# Altium schematic sheet MCU.SchDoc
size A4
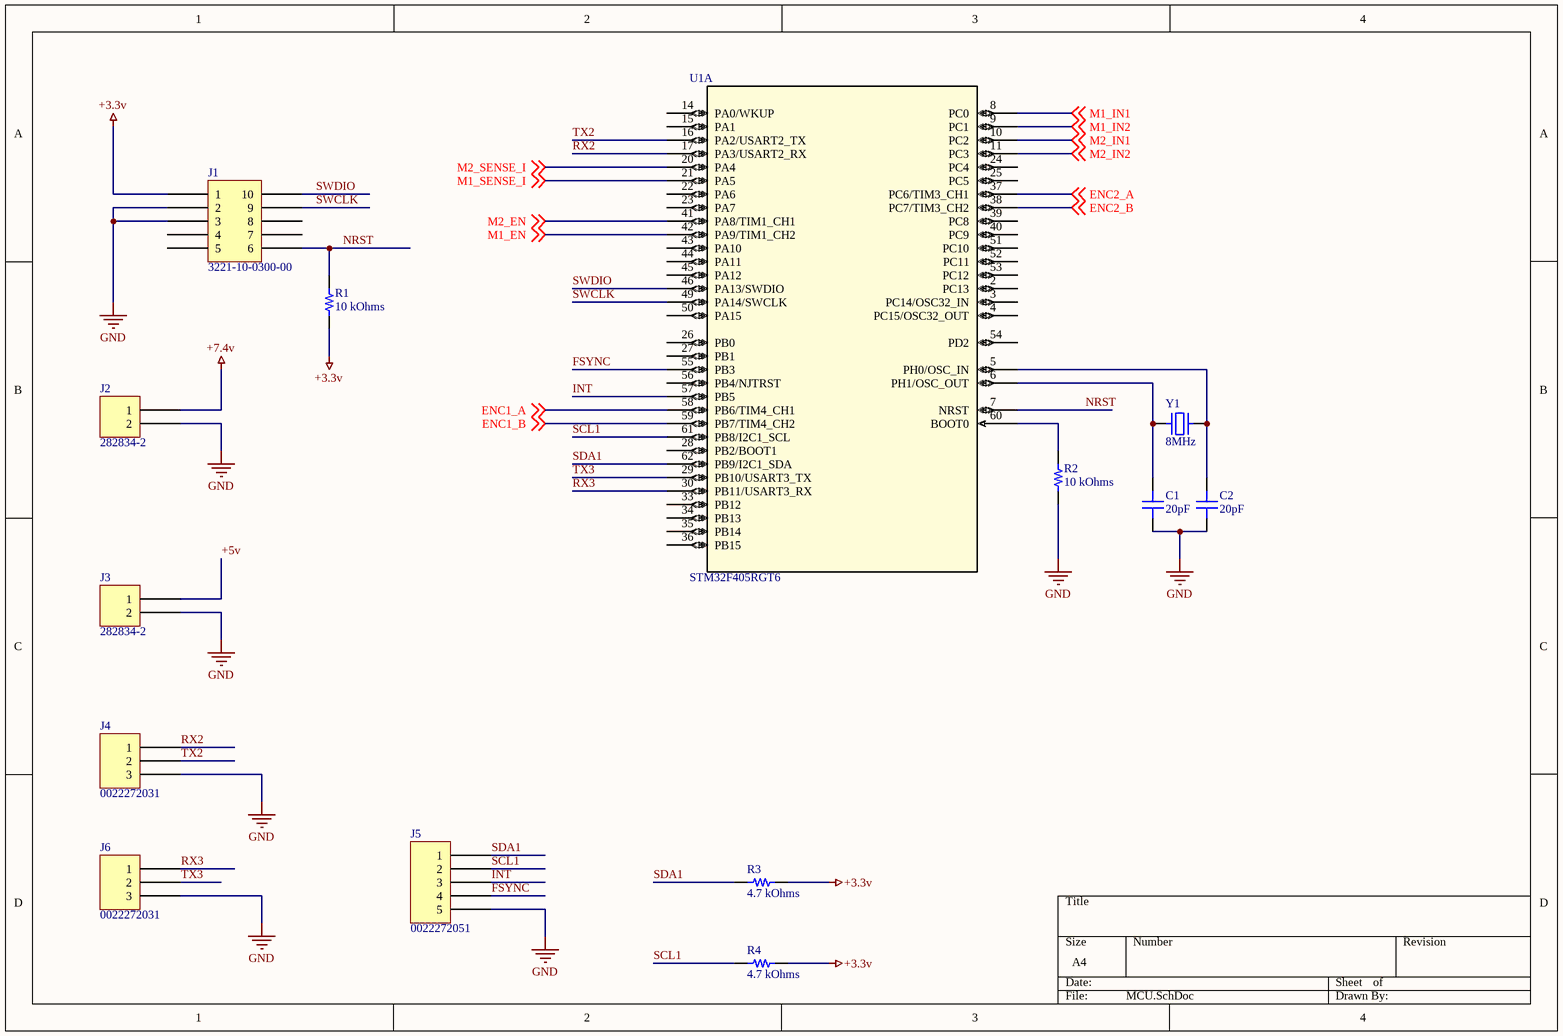
[diagram p0: MCU.SchDoc]

## Parts
C1  20pF  [CAP 0805_2012]
C2  20pF  [CAP 0805_2012]
J1  3221-10-0300-00  [CNC TECH 3221-10-0300-00]
J2  282834-2  [TE 282834-2]
J3  282834-2  [TE 282834-2]
J4  0022272031  [MOLEX KK 0022272031]
J5  0022272051  [MOLEX KK 0022272051]
J6  0022272031  [MOLEX KK 0022272031]
R1  10 kOhms  [RES 0805_2012]
R2  10 kOhms  [RES 0805_2012]
R3  4.7 kOhms  [RES 0805_2012]
R4  4.7 kOhms  [RES 0805_2012]
U1  STM32F405RGT6  [LQFP64-10x10mm]  (part A of 2)
Y1  8MHz  [NDK NX5032GA]

## Nets
+3.3v: J1.1 R1.2 R3.2 R4.2
+7.4v: J2.1
GND: C1.1 C2.1 J1.2 J1.3 J2.2 J3.2 J4.3 J5.5 J6.3 R2.1
+5v: J3.1
ENC1_A: U1.58(PB6/TIM4_CH1) ; off-sheet ENC1_A
ENC1_B: U1.59(PB7/TIM4_CH2) ; off-sheet ENC1_B
ENC2_A: U1.37(PC6/TIM3_CH1) ; off-sheet ENC2_A
ENC2_B: U1.38(PC7/TIM3_CH2) ; off-sheet ENC2_B
FSYNC: J5.4 U1.55(PB3)
INT: J5.3 U1.57(PB5)
M1_EN: U1.42(PA9/TIM1_CH2) ; off-sheet M1_EN
M1_IN1: U1.8(PC0) ; off-sheet M1_IN1
M1_IN2: U1.9(PC1) ; off-sheet M1_IN2
M1_SENSE_I: U1.21(PA5) ; off-sheet M1_SENSE_I
M2_EN: U1.41(PA8/TIM1_CH1) ; off-sheet M2_EN
M2_IN1: U1.10(PC2) ; off-sheet M2_IN1
M2_IN2: U1.11(PC3) ; off-sheet M2_IN2
M2_SENSE_I: U1.20(PA4) ; off-sheet M2_SENSE_I
NRST: J1.6 R1.1 U1.7(NRST)
RX2: J4.1 U1.17(PA3/USART2_RX)
RX3: J6.1 U1.30(PB11/USART3_RX)
SCL1: J5.2 R4.1 U1.61(PB8/I2C1_SCL)
SDA1: J5.1 R3.1 U1.62(PB9/I2C1_SDA)
SWCLK: J1.9 U1.49(PA14/SWCLK)
SWDIO: J1.10 U1.46(PA13/SWDIO)
TX2: J4.2 U1.16(PA2/USART2_TX)
TX3: J6.2 U1.29(PB10/USART3_TX)
NetC1_2: C1.2 U1.6(PH1/OSC_OUT) Y1.1
NetC2_2: C2.2 U1.5(PH0/OSC_IN) Y1.2
NetR2_2: R2.2 U1.60(BOOT0)

Not connected (* = marked no-connect by the designer): J1 4 5 7 8; U1 2(PC13) 3(PC14/OSC32_IN) 4(PC15/OSC32_OUT) 14(PA0/WKUP) 15(PA1) 22(PA6) 23(PA7) 24(PC4) 25(PC5) 26(PB0) 27(PB1) 28(PB2/BOOT1) 33(PB12) 34(PB13) 35(PB14) 36(PB15) 39(PC8) 40(PC9) 43(PA10) 44(PA11) 45(PA12) 50(PA15) 51(PC10) 52(PC11) 53(PC12) 54(PD2) 56(PB4/NJTRST)

## Library data of the parts
C1 C2 = C0805C200J4GAC7800: CAP CER 20PF 16V C0G/NP0 0805; Manufacturer: KEMET; Temperature Coefficient: C0G, NP0; Tolerance: ±5%; Part Number: C0805C200J4GAC7800; Value: 20pF; Applications: General Purpose; Capacitance: 20pF; ComponentLink1Description: Datasheet; ComponentLink1URL: https://api.kemet.com/component-edge/download/datasheet/C0805C200J4GAC7800.pdf; ComponentLink2Description: DigiKey Link; ComponentLink2URL: http://digikey.com/product-detail/en/kemet/C0805C200J4GAC7800/399-9987-1-ND/3736986; Device Package: 0805 (2012 Metric); Features: Low ESL; LastUpdated: 9/2/2020 1:04:36 AM; Lifecycle Status: Active; Minimum Order: 1; Mounting Type: Surface Mount, MLCC; Operating Temperature: -55°C ~ 125°C; Package / Case: 0805 (2012 Metric); Packaging: TapeAndReel; PartId: 5865; Part Status: Active; Price: 0.06; Series: SMD Comm C0G; Size / Dimension: 0.079" L x 0.049" W (2.00mm x 1.25mm); Supplier 1: DigiKey; Supplier Part Number 1: 399-9987-1-ND; Thickness (Max): 0.035" (0.88mm); Voltage - Rated: 16V
J1 = 3221-10-0300-00: CONN HEADER SMD 10POS 1.27MM; Manufacturer: CNC Tech; Current Rating (Amps): 1A; Material Flammability Rating: UL94 V-0; Number of Positions: 10; Number of Positions Loaded: All; Pitch - Mating: 0.050" (1.27mm); Shrouding: Shrouded - 4 Wall; Style: Board to Cable/Wire; Part Number: 3221-10-0300-00; ComponentLink1Description: Datasheet; ComponentLink1URL: http://cnctech.us/idcmatching2.pdf; ComponentLink2Description: DigiKey Link; ComponentLink2URL: http://digikey.com/product-detail/en/cnc-tech/3221-10-0300-00/1175-1735-ND/4878946; Connector Type: Header; Contact Finish - Mating: Gold; Contact Finish - Post: Gold; Contact Finish Thickness - Mating: Flash; Contact Material: Brass; Contact Shape: Square; Contact Type: Male Pin; Fastening Type: Push-Pull; Features: Keying Slot; Insulation Height: 0.213" (5.40mm); Insulation Material: Polyamide (PA6T), Nylon 6T; LastUpdated: 1/13/2020 12:09:21 AM; Lifecycle Status: Active; Minimum Order: 1; Mounting Type: Surface Mount; Number of Rows: 2; Operating Temperature: -40°C ~ 105°C; Packaging: Tray; PartId: 109; Part Status: Active; Price: 0.73; Row Spacing - Mating: 0.050" (1.27mm); Series: -; Supplier 1: DigiKey; Supplier Part Number 1: 1175-1735-ND; Termination: Solder
J2 J3 = 282834-2: TERM BLK 2P SIDE ENT 2.54MM PCB; Manufacturer: TE Connectivity AMP Connectors; Current: 10A; Mating Orientation: Horizontal with Board; Number of Levels: 1; Pitch: 0.100" (2.54mm); Positions Per Level: 2; Voltage: 150V; Wire Gauge: 16-30 AWG; Wire Termination: Screw - Rising Cage Clamp; Part Number: 282834-2; Color: Green; ComponentLink1Description: Datasheet; ComponentLink1URL: https://www.te.com/commerce/DocumentDelivery/DDEController?Action=srchrtrv&DocNm=282834&DocType=Customer+Drawing&DocLang=English; ComponentLink2Description: DigiKey Link; ComponentLink2URL: http://digikey.com/product-detail/en/te-connectivity-amp-connectors/282834-2/A98333-ND/1150135; LastUpdated: 1/15/2020 4:15:38 AM; Lifecycle Status: Active; Minimum Order: 1; Mounting Type: Through Hole; Packaging: Bulk; Part Status: Active; Price: 0.88; Series: Buchanan; Supplier 1: DigiKey; Supplier Part Number 1: A98333-ND
J4 J6 = 0022272031: CONN HEADER VERT 3POS 2.54MM; Manufacturer: Molex; Contact Length - Mating: 0.295" (7.49mm); Contact Length - Post: 0.140" (3.56mm); Material Flammability Rating: UL94 V-0; Number of Positions: 3; Number of Positions Loaded: All; Overall Contact Length: 0.560" (14.22mm); Pitch - Mating: 0.100" (2.54mm); Shrouding: Shrouded - 1 Wall; Style: Board to Cable/Wire; Part Number: 0022272031; ComponentLink1Description: Datasheet; ComponentLink1URL: https://www.molex.com/pdm_docs/sd/022272031_sd.pdf; ComponentLink2Description: DigiKey Link; ComponentLink2URL: http://digikey.com/product-detail/en/molex/0022272031/WM4112-ND/1130578; Connector Type: Header; Contact Finish - Mating: Tin; Contact Finish - Post: Tin; Contact Finish Thickness - Mating: 100.0µin (2.54µm); Contact Material: Brass; Contact Shape: Square; Contact Type: Male Pin; Fastening Type: Friction Lock; Insulation Color: Natural; Insulation Height: 0.461" (11.70mm); Insulation Material: Polyamide (PA), Nylon; LastUpdated: 1/12/2020 11:51:54 PM; Lifecycle Status: Active; Minimum Order: 1; Mounting Type: Through Hole; Number of Rows: 1; Packaging: Bulk; PartId: 77; Part Status: Active; Price: 0.37; Series: KK 6410; Supplier 1: DigiKey; Supplier Part Number 1: WM4112-ND; Termination: Solder
J5 = 0022272051: CONN HEADER VERT 5POS 2.54MM; Manufacturer: Molex; Contact Length - Mating: 0.295" (7.49mm); Contact Length - Post: 0.140" (3.56mm); Material Flammability Rating: UL94 V-0; Number of Positions: 5; Number of Positions Loaded: All; Overall Contact Length: 0.560" (14.22mm); Pitch - Mating: 0.100" (2.54mm); Shrouding: Shrouded - 1 Wall; Style: Board to Cable/Wire; Part Number: 0022272051; ComponentLink1Description: Datasheet; ComponentLink1URL: https://www.molex.com/pdm_docs/sd/022272051_sd.pdf; ComponentLink2Description: DigiKey Link; ComponentLink2URL: http://digikey.com/product-detail/en/molex/0022272051/WM4114-ND/1130580; Connector Type: Header; Contact Finish - Mating: Tin; Contact Finish - Post: Tin; Contact Finish Thickness - Mating: 100.0µin (2.54µm); Contact Material: Brass; Contact Shape: Square; Contact Type: Male Pin; Fastening Type: Friction Lock; Insulation Color: Natural; Insulation Height: 0.461" (11.70mm); Insulation Material: Polyamide (PA), Nylon; LastUpdated: 1/12/2020 11:52:16 PM; Lifecycle Status: Active; Minimum Order: 1; Mounting Type: Through Hole; Number of Rows: 1; Packaging: Bulk; PartId: 79; Part Status: Active; Price: 0.46; Series: KK 6410; Supplier 1: DigiKey; Supplier Part Number 1: WM4114-ND; Termination: Solder
R1 = RMCS0805JT10K0: RES 10K OHM 5% 1/8W 0805; Manufacturer: Stackpole Electronics Inc; Power (Watts): 0.125W, 1/8W; Temperature Coefficient: ±100ppm/°C; Part Number: RMCS0805JT10K0; Value: 10 kOhms; ComponentLink1Description: Datasheet; ComponentLink1URL: https://www.seielect.com/catalog/sei-rmcs.pdf; ComponentLink2Description: DigiKey Link; ComponentLink2URL: http://digikey.com/product-detail/en/stackpole-electronics-inc/RMCS0805JT10K0/RMCS0805JT10K0CT-ND/9770325; Composition: Thick Film; Device Package: 0805 (2012 Metric); Features: Anti-Sulfur; Height - Seated (Max): 0.024" (0.60mm); LastUpdated: 9/2/2020 1:14:40 AM; Lifecycle Status: Active; Minimum Order: 1; Number of Terminations: 2; Operating Temperature: -55°C ~ 155°C; Package / Case: 0805 (2012 Metric); Packaging: TapeAndReel; PartId: 46907; Part Status: Active; Price: 0.01; Resistance: 10 kOhms; Series: RMCS; Size / Dimension: 0.079" L x 0.049" W (2.00mm x 1.25mm); Supplier 1: DigiKey; Supplier Part Number 1: RMCS0805JT10K0CT-ND; Supplier Device Package: 0805; Tolerance: ±5%
R2 = RC0805JR-0710KL: RES SMD 10K OHM 5% 1/8W 0805; Manufacturer: Yageo; Power (Watts): 0.125W, 1/8W; Temperature Coefficient: ±100ppm/°C; Part Number: RC0805JR-0710KL; Value: 10 kOhms; ComponentLink1Description: Datasheet; ComponentLink1URL: https://www.yageo.com/upload/media/product/productsearch/datasheet/rchip/PYu-RC_Group_51_RoHS_L_10.pdf; ComponentLink2Description: DigiKey Link; ComponentLink2URL: http://digikey.com/product-detail/en/yageo/RC0805JR-0710KL/311-10KARCT-ND/731188; Composition: Thick Film; Device Package: 0805 (2012 Metric); Features: Moisture Resistant; Height - Seated (Max): 0.024" (0.60mm); LastUpdated: 9/2/2020 1:15:00 AM; Lifecycle Status: Active; Minimum Order: 1; Number of Terminations: 2; Operating Temperature: -55°C ~ 155°C; Package / Case: 0805 (2012 Metric); Packaging: CutTape; PartId: 38737; Part Status: Active; Price: 0.10; Resistance: 10 kOhms; Series: RC; Size / Dimension: 0.079" L x 0.049" W (2.00mm x 1.25mm); Supplier 1: DigiKey; Supplier Part Number 1: 311-10KARCT-ND; Supplier Device Package: 0805; Tolerance: ±5%
R3 R4 = CRCW08054K70JNTA: RES SMD 4.7K OHM 5% 1/8W 0805; Manufacturer: Vishay Dale; Power (Watts): 0.125W, 1/8W; Temperature Coefficient: ±200ppm/°C; Part Number: CRCW08054K70JNTA; Value: 4.7 kOhms; ComponentLink1Description: Datasheet; ComponentLink1URL: http://www.vishay.com/docs/20008/dcrcw.pdf; ComponentLink2Description: DigiKey Link; ComponentLink2URL: http://digikey.com/product-detail/en/vishay-dale/CRCW08054K70JNTA/541-3029-1-ND/6073672; Composition: Thick Film; Device Package: 0805 (2012 Metric); Features: Automotive AEC-Q200; Height - Seated (Max): 0.020" (0.50mm); LastUpdated: 9/2/2020 1:15:17 AM; Lifecycle Status: Active; Minimum Order: 1; Number of Terminations: 2; Operating Temperature: -55°C ~ 155°C; Package / Case: 0805 (2012 Metric); Packaging: TapeAndReel; PartId: 30842; Part Status: Active; Price: 0.01; Ratings: AEC-Q200; Resistance: 4.7 kOhms; Series: CRCW; Size / Dimension: 0.079" L x 0.049" W (2.00mm x 1.25mm); Supplier 1: DigiKey; Supplier Part Number 1: 541-3029-1-ND; Supplier Device Package: 0805; Tolerance: ±5%
U1 = STM32F405RGT6: No Description Available; Vendor: STMicroelectronics; Built_By: EMA_UL_Team; SourceLibrary: Updates_to_database_2020-10-19; Manufacturer_Part_Number: STM32F405RGT6; Copyright: Copyright (C) 2018 Accelerated Designs. All rights reserved; RefDes: RefDes; Type: DEV
Y1 = NX5032GA-8MHZ-EXS00A-CG07039: CRYSTAL 8MHZ 18PF SMD; Manufacturer: NDK America, Inc.; ESR (Equivalent Series Resistance): 300 Ohms; Frequency Stability: ±30ppm; Frequency Tolerance: ±20ppm; Operating Mode: Fundamental; Part Number: NX5032GA-8MHZ-EXS00A-CG07039; ComponentLink1Description: Datasheet; ComponentLink1URL: //media.digikey.com/pdf/Data%20Sheets/NDK%20PDFs/NX5032GA-8MHz-EXS00A-CG07039.pdf; ComponentLink2Description: DigiKey Link; ComponentLink2URL: http://digikey.com/product-detail/en/ndk-america-inc/NX5032GA-8MHZ-EXS00A-CG07039/644-1318-1-ND/8275436; Frequency: 8MHz; Height - Seated (Max): 0.059" (1.50mm); LastUpdated: 02.09.2020 1:22:00; Lifecycle Status: Active; Load Capacitance: 18pF; Minimum Order: 1; Mounting Type: Surface Mount; Operating Temperature: -40°C ~ 85°C; Package / Case: 2-SMD, No Lead; Packaging: TapeAndReel; PartId: 609; Part Status: Active; Price: 0.37; Series: NX5032GA; Size / Dimension: 0.197" L x 0.126" W (5.00mm x 3.20mm); Supplier 1: DigiKey; Supplier Part Number 1: 644-1318-1-ND; Type: MHz Crystal; Value: 8MHz